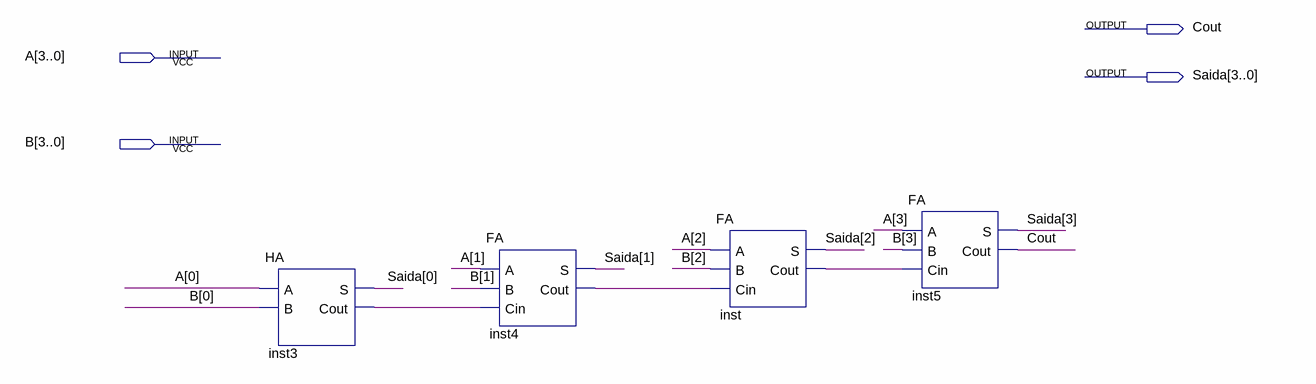
[diagram p0: schematic sheet]
// Quartus schematic lab01.bdf as structural Verilog: 4 symbols, 4 pins
module lab01 (
  input  [3:0] A,
  input  [3:0] B,
  output Cout,
  output [3:0] Saida
);

  wire inst3_cout, inst4_cout, inst_cout;

  HA inst3 (.A(A[0]), .B(B[0]), .S(Saida[0]), .Cout(inst3_cout));
  FA inst4 (.A(A[1]), .B(B[1]), .Cin(inst3_cout), .S(Saida[1]), .Cout(inst4_cout));
  FA inst (.A(A[2]), .B(B[2]), .Cin(inst4_cout), .S(Saida[2]), .Cout(inst_cout));
  FA inst5 (.A(A[3]), .B(B[3]), .Cin(inst_cout), .S(Saida[3]), .Cout(Cout));
endmodule
